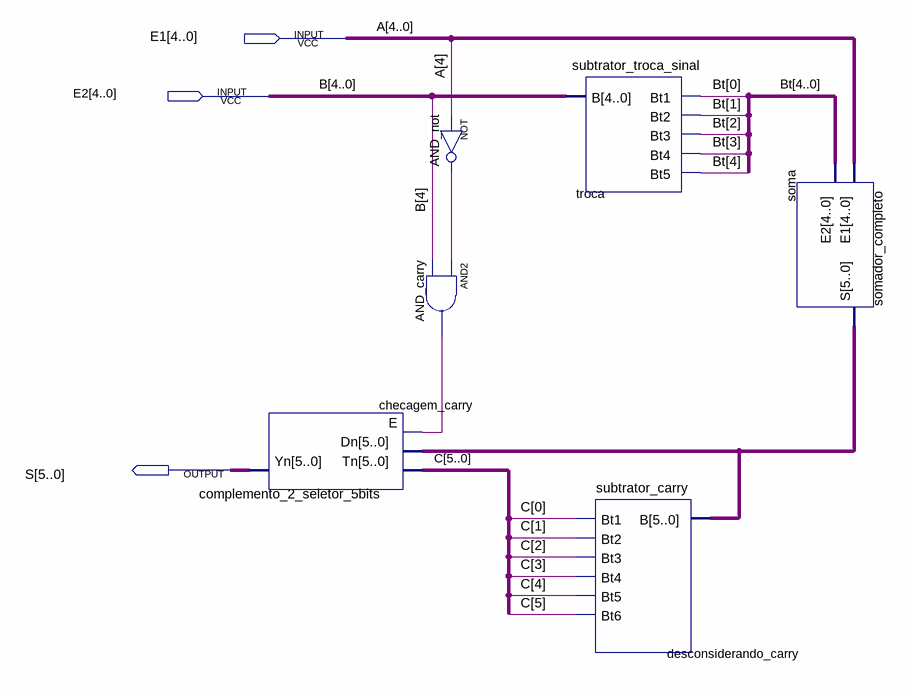
[diagram p0: schematic sheet]
// Quartus schematic subtrator_completo.bdf as structural Verilog: 6 symbols, 3 pins
module subtrator_completo (
  input  [4:0] E1,
  input  [4:0] E2,
  output [5:0] S
);

  wire AND_carry_out, AND_not_out;
  wire [4:0] Bt;
  wire [5:0] C, soma_s;

  complemento_2_seletor_5bits checagem_carry (.Tn(C), .Dn(soma_s), .E(AND_carry_out), .Yn(S));
  and AND_carry (AND_carry_out, AND_not_out, E2[4]);
  not AND_not (AND_not_out, E1[4]);
  subtrator_troca_sinal troca (.B(E2), .Bt1(Bt[0]), .Bt2(Bt[1]), .Bt3(Bt[2]), .Bt4(Bt[3]), .Bt5(Bt[4]));
  subtrator_carry desconsiderando_carry (
    .B(soma_s), .Bt1(C[0]), .Bt2(C[1]), .Bt3(C[2]), .Bt4(C[3]), .Bt5(C[4]), .Bt6(C[5]));
  somador_completo soma (.E1(E1), .E2(Bt), .S(soma_s));

  // Other names for the same wires on the sheet: A[4:0] = E1; B[4:0] = E2
endmodule
